# EAGLE design big shield (EAGLE 8.6.1)
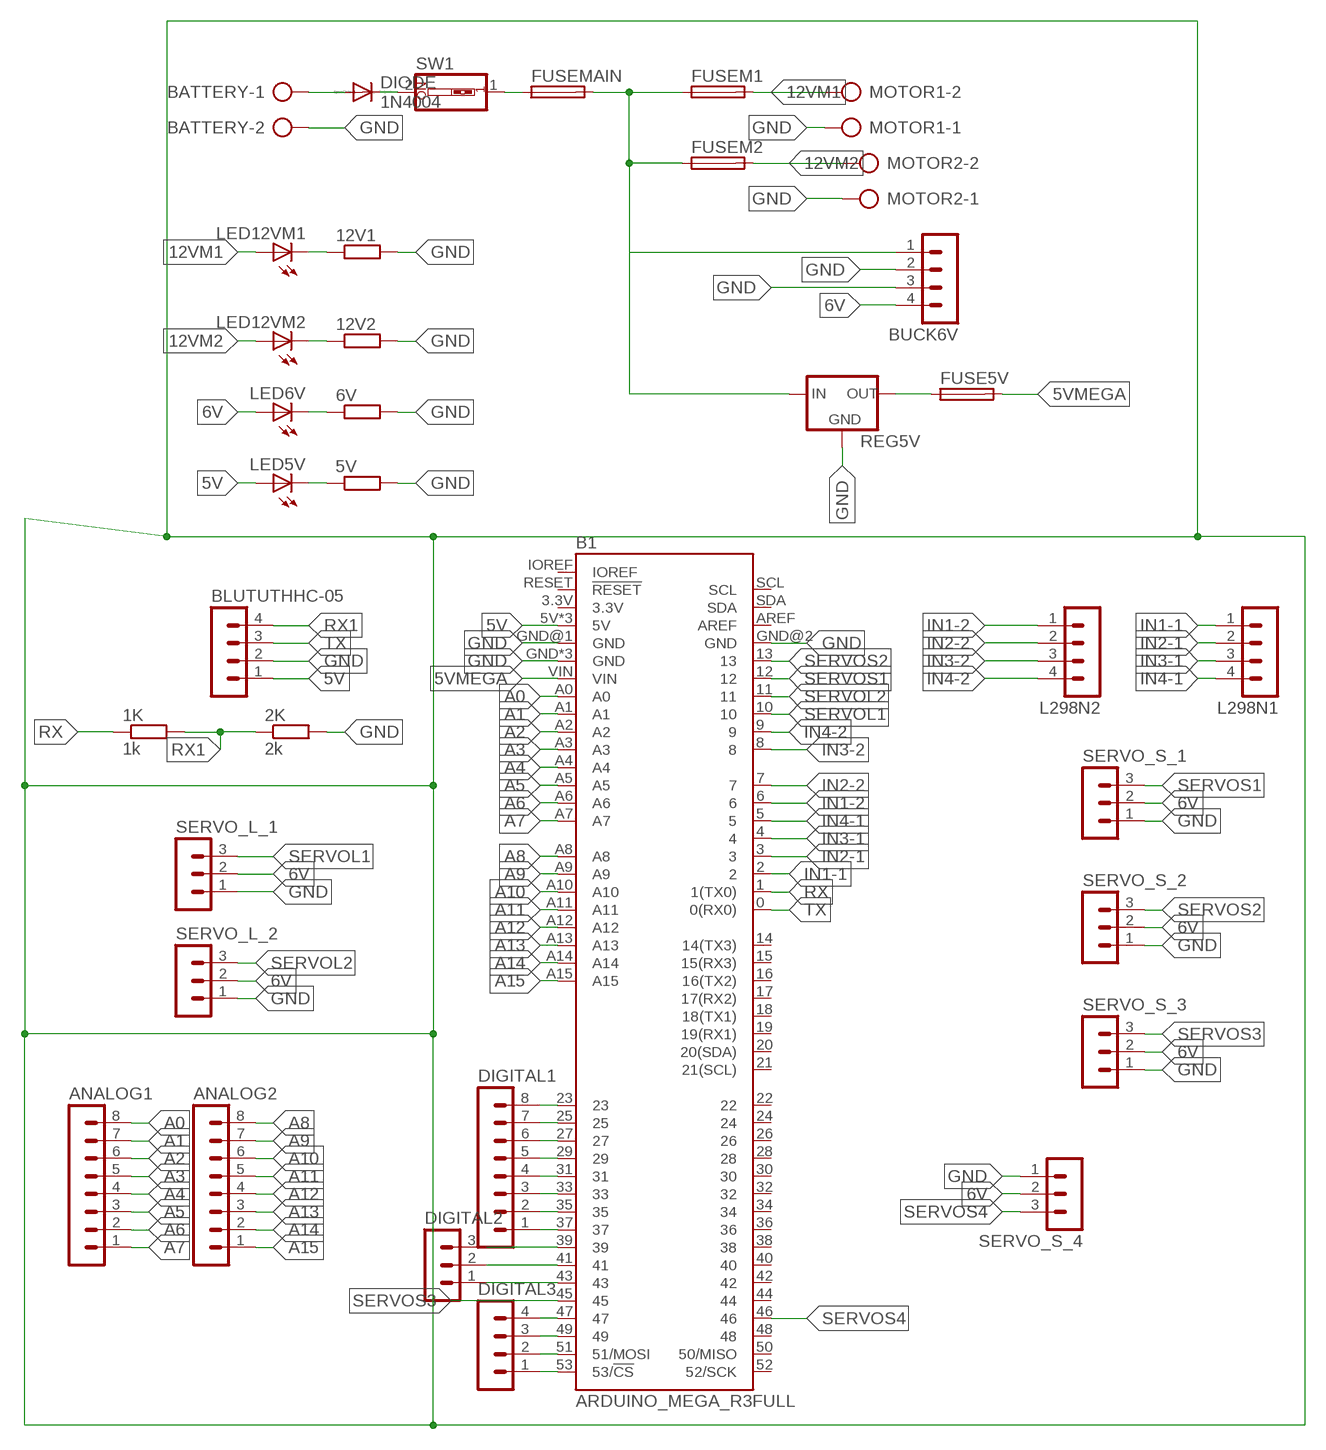
[diagram p0: schematic, sheet 1]

## Parts
1K  1k  R-EU_0207/10  [0207/10]
2K  2k  R-EU_0207/10  [0207/10]
5V  R-EU_0204/7  [0204/7]
6V  R-EU_0204/7  [0204/7]
12V1  R-EU_0204/7  [0204/7]
12V2  R-EU_0204/7  [0204/7]
ANALOG1  MA08-1  [MA08-1]
ANALOG2  MA08-1  [MA08-1]
B1  ARDUINO_MEGA_R3FULL  [ARDUINO_MEGA_NO_SILK]
BATTERY  AK500/2-H  [AK500/2-H]
BLUTUTHHC-05  MA04-1  [MA04-1]
BUCK6V  MA04-1  [MA04-1]
DIGITAL1  MA08-1  [MA08-1]
DIGITAL2  MA03-1  [MA03-1]
DIGITAL3  MA04-1  [MA04-1]
DIODE  1N4004  [DO41-10]
FUSE5V  SH22,5  [SH22,5]
FUSEM1  SH22,5  [SH22,5]
FUSEM2  SH22,5  [SH22,5]
FUSEMAIN  SH22,5  [SH22,5]
L298N1  MA04-1  [MA04-1]
L298N2  MA04-1  [MA04-1]
LED5V  LEDLSU260  [LSU260]
LED6V  LEDLSU260  [LSU260]
LED12VM1  LEDLSU260  [LSU260]
LED12VM2  LEDLSU260  [LSU260]
MOTOR1  AK500/2-H  [AK500/2-H]
MOTOR2  AK500/2-H  [AK500/2-H]
REG5V  78XXS  [78XXS]
SERVO_L_1  MA03-1  [MA03-1]
SERVO_L_2  MA03-1  [MA03-1]
SERVO_S_1  MA03-1  [MA03-1]
SERVO_S_2  MA03-1  [MA03-1]
SERVO_S_3  MA03-1  [MA03-1]
SERVO_S_4  MA03-1  [MA03-1]
SW1  SW_DIP-1  [EDG-01]

## Nets
5V: B1.5V B1.5V@1(5V) B1.5V@2(5V) BLUTUTHHC-05.1 LED5V.A
5VMEGA: B1.VIN FUSE5V.2
6V: BUCK6V.4 LED6V.A SERVO_L_1.2 SERVO_L_2.2 SERVO_S_1.2 SERVO_S_2.2 SERVO_S_3.2 SERVO_S_4.2
12V1: BUCK6V.1 FUSEM1.1 FUSEM2.1 FUSEMAIN.2 REG5V.IN
12VM1: FUSEM1.2 LED12VM1.A MOTOR1.2
12VM2: FUSEM2.2 LED12VM2.A MOTOR2.2
A0: ANALOG1.8 B1.A0
A1: ANALOG1.7 B1.A1
A2: ANALOG1.6 B1.A2
A3: ANALOG1.5 B1.A3
A4: ANALOG1.4 B1.A4
A5: ANALOG1.3 B1.A5
A6: ANALOG1.2 B1.A6
A7: ANALOG1.1 B1.A7
A8: ANALOG2.8 B1.A8
A9: ANALOG2.7 B1.A9
A10: ANALOG2.6 B1.A10
A11: ANALOG2.5 B1.A11
A12: ANALOG2.4 B1.A12
A13: ANALOG2.3 B1.A13
A14: ANALOG2.2 B1.A14
A15: ANALOG2.1 B1.A15
GND: 2K.2 5V.2 6V.2 12V1.2 12V2.2 B1.GND B1.GND@1(GND) B1.GND@2(GND) B1.GND@3(GND) B1.GND@4(GND) BATTERY.2 BLUTUTHHC-05.2 BUCK6V.2 BUCK6V.3 MOTOR1.1 MOTOR2.1 REG5V.GND SERVO_L_1.1 SERVO_L_2.1 SERVO_S_1.1 SERVO_S_2.1 SERVO_S_3.1 SERVO_S_4.1
IN1-1: B1.2 L298N1.1
IN1-2: B1.6 L298N2.1
IN2-1: B1.3 L298N1.2
IN2-2: B1.7 L298N2.2
IN3-1: B1.4 L298N1.3
IN3-2: B1.8 L298N2.3
IN4-1: B1.5 L298N1.4
IN4-2: B1.9 L298N2.4
N$1: BATTERY.1 DIODE.A
N$2: DIODE.C SW1.2
N$3: FUSEMAIN.1 SW1.1
N$6: FUSE5V.1 REG5V.OUT
N$7: 6V.1 LED6V.K(C)
N$8: 12V2.1 LED12VM2.K(C)
N$9: 12V1.1 LED12VM1.K(C)
N$10: 5V.1 LED5V.K(C)
N$26: B1.23 DIGITAL1.8
N$27: B1.25 DIGITAL1.7
N$28: B1.27 DIGITAL1.6
N$29: B1.29 DIGITAL1.5
N$30: B1.31 DIGITAL1.4
N$31: B1.33 DIGITAL1.3
N$32: B1.35 DIGITAL1.2
N$33: B1.37 DIGITAL1.1
N$34: B1.39 DIGITAL2.3
N$35: B1.41 DIGITAL2.2
N$36: B1.43 DIGITAL2.1
N$37: B1.47 DIGITAL3.4
N$38: B1.49 DIGITAL3.3
N$39: B1.51(51/MOSI) DIGITAL3.2
N$40: B1.53(53/!CS) DIGITAL3.1
RX: 1K.1 B1.1(1(TX0))
RX1: 1K.2 2K.1 BLUTUTHHC-05.4
SERVOL1: B1.10 SERVO_L_1.3
SERVOL2: B1.11 SERVO_L_2.3
SERVOS1: B1.12 SERVO_S_1.3
SERVOS2: B1.13 SERVO_S_2.3
SERVOS3: B1.45 SERVO_S_3.3
SERVOS4: B1.46 SERVO_S_4.3
TX: B1.0(0(RX0)) BLUTUTHHC-05.3
Unconnected: B1.3.3V B1.14(14(TX3)) B1.15(15(RX3)) B1.16(16(TX2)) B1.17(17(RX2)) B1.18(18(TX1)) B1.19(19(RX1)) B1.20(20(SDA)) B1.21(21(SCL)) B1.22 B1.24 B1.26 B1.28 B1.30 B1.32 B1.34 B1.36 B1.38 B1.40 B1.42 B1.44 B1.48 B1.50(50/MISO) B1.52(52/SCK) B1.AREF B1.IOREF B1.RESET(!RESET) B1.SCL B1.SDA

## Library data of the parts
1K 2K = rcl:R-EU_: RESISTOR, European symbol; SPICEPREFIX: R
5V 6V 12V1 12V2 = resistor:R-EU_: RESISTOR, European symbol
ANALOG1 ANALOG2 DIGITAL1 = con-lstb:MA08-1: PIN HEADER; OC_FARNELL: unknown; OC_NEWARK: unknown
B1 = SparkFun-Boards:ARDUINO_MEGA_R3: Arduino Mega R3 ATmega2560 R3 compatible footprint. SparkFun Products: Arduino Mega 2560 R3 <https://www.sparkfun.com/products/11061>
BATTERY MOTOR1 MOTOR2 = con-ptr500:AK500/2-H: CONNECTOR Aug. 2004 / PTR Meßtechnik: Die Bezeichnung der Serie AK505 wurde geändert. Es handelt sich hierbei um AK500 in horizontaler Ausführung.; OC_FARNELL: unknown; OC_NEWARK: unknown
BLUTUTHHC-05 BUCK6V DIGITAL3 L298N1 L298N2 = con-lstb:MA04-1: PIN HEADER; OC_FARNELL: unknown; OC_NEWARK: unknown
DIGITAL2 SERVO_L_1 SERVO_L_2 SERVO_S_1-SERVO_S_4 = con-lstb:MA03-1: PIN HEADER; OC_FARNELL: unknown; OC_NEWARK: unknown
DIODE = diode:1N4004: DIODE general purpose rectifier, 1 A
FUSE5V FUSEM1 FUSEM2 FUSEMAIN = fuse:SH22,5: FUSE HOLDER grid 22,5 mm, OGN0031 8201, Schurter (Buerklin); MF: SCHURTER; MPN: 0031.8201; OC_FARNELL: 1162740; OC_NEWARK: 96F8317
LED5V LED6V LED12VM1 LED12VM2 = led:LED: LED OSRAM: - CHIPLED LG R971, LG N971, LY N971, LG Q971, LY Q971, LO R971, LY R971 LH N974, LH R974 LS Q976, LO Q976, LY Q976 LO Q996 - Hyper CHIPLED LW Q18S LB Q993, LB Q99A, LB R99A - SideLED LS A670, LO A670, LY A670, LG A670, LP A670 LB A673, LV A673, LT A673, LW A673 LH A674 LY A675 LS A676, LA A676, LO A676, LY A676, LW A676 LS A679, LY A679, LG A679 - Hyper Micro SIDELED® LS Y876, LA Y876, LO Y876, LY Y876 LT Y87S - SmartLED LW L88C, LW L88S LB L89C, LB L89S, LG L890 LS L89K, LO L89K, LY L89K LS L896, LA L896, LO L896, LY L896 - TOPLED LS T670, LO T670, LY T670, LG T670, LP T670 LSG T670, LSP T670, LSY T670, LOP T670, LYG T670 LG T671, LOG T671, LSG T671 LB T673, LV T673, LT T673, LW T673 LH T674 LS T676, LA T676, LO T676, LY T676, LB T676, LH T676, LSB T676, LW T676 LB T67C, LV T67C, LT T67C, LS T67K, LO T67K, LY T67K, LW E67C LS E67B, LA E67B, LO E67B, LY E67B, LB E67C, LV E67C, LT E67C LW T67C LS T679, LY T679, LG T679 LS T770, LO T770, LY T770, LG T770, LP T770 LB T773, LV T773, LT T773, LW T773 LH T774 LS E675, LA E675, LY E675, LS T675 LS T776, LA T776, LO T776, LY T776, LB T776 LHGB T686 LT T68C, LB T68C - Hyper Mini TOPLED® LB M676 - Mini TOPLED Santana® LG M470 LS M47K, LO M47K, LY M47K Source: http://www.osram.convergy.de LUXEON: - LUMILED® LXK2-PW12-R00, LXK2-PW12-S00, LXK2-PW14-U00, LXK2-PW14-V00 LXK2-PM12-R00, LXK2-PM12-S00, LXK2-PM14-U00 LXK2-PE12-Q00, LXK2-PE12-R00, LXK2-PE12-S00, LXK2-PE14-T00, LXK2-PE14-U00 LXK2-PB12-K00, LXK2-PB12-L00, LXK2-PB12-M00, LXK2-PB14-N00, LXK2-PB14-P00, LXK2-PB14-Q00 LXK2-PR12-L00, LXK2-PR12-M00, LXK2-PR14-Q00, LXK2-PR14-R00 LXK2-PD12-Q00, LXK2-PD12-R00, LXK2-PD12-S00 LXK2-PH12-R00, LXK2-PH12-S00 LXK2-PL12-P00, LXK2-PL12-Q00, LXK2-PL12-R00 Source: www.luxeon.com KINGBRIGHT: KA-3528ASYC Source: www.kingbright.com
REG5V = v-reg:78XXS: VOLTAGE REGULATOR
SW1 = special:SW_DIP-1: DIP SWITCH

## Board
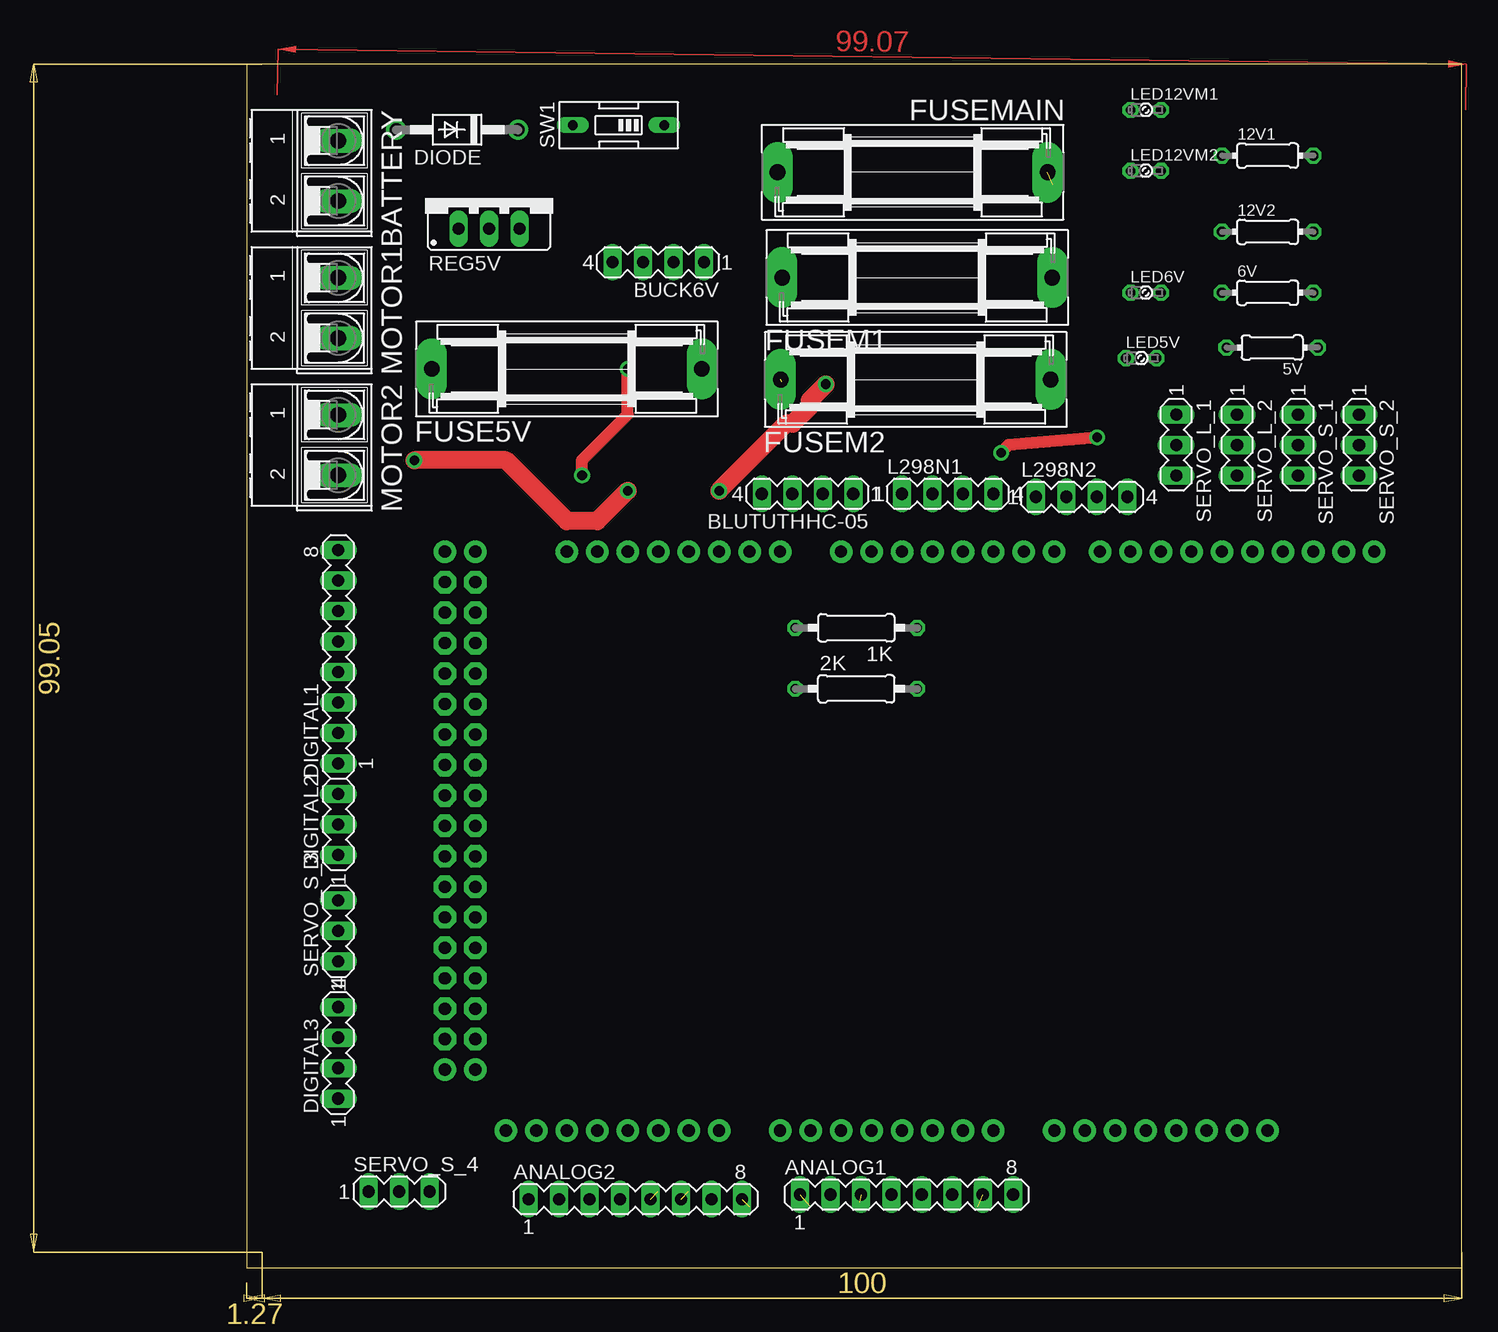
[diagram p1: board, top side]
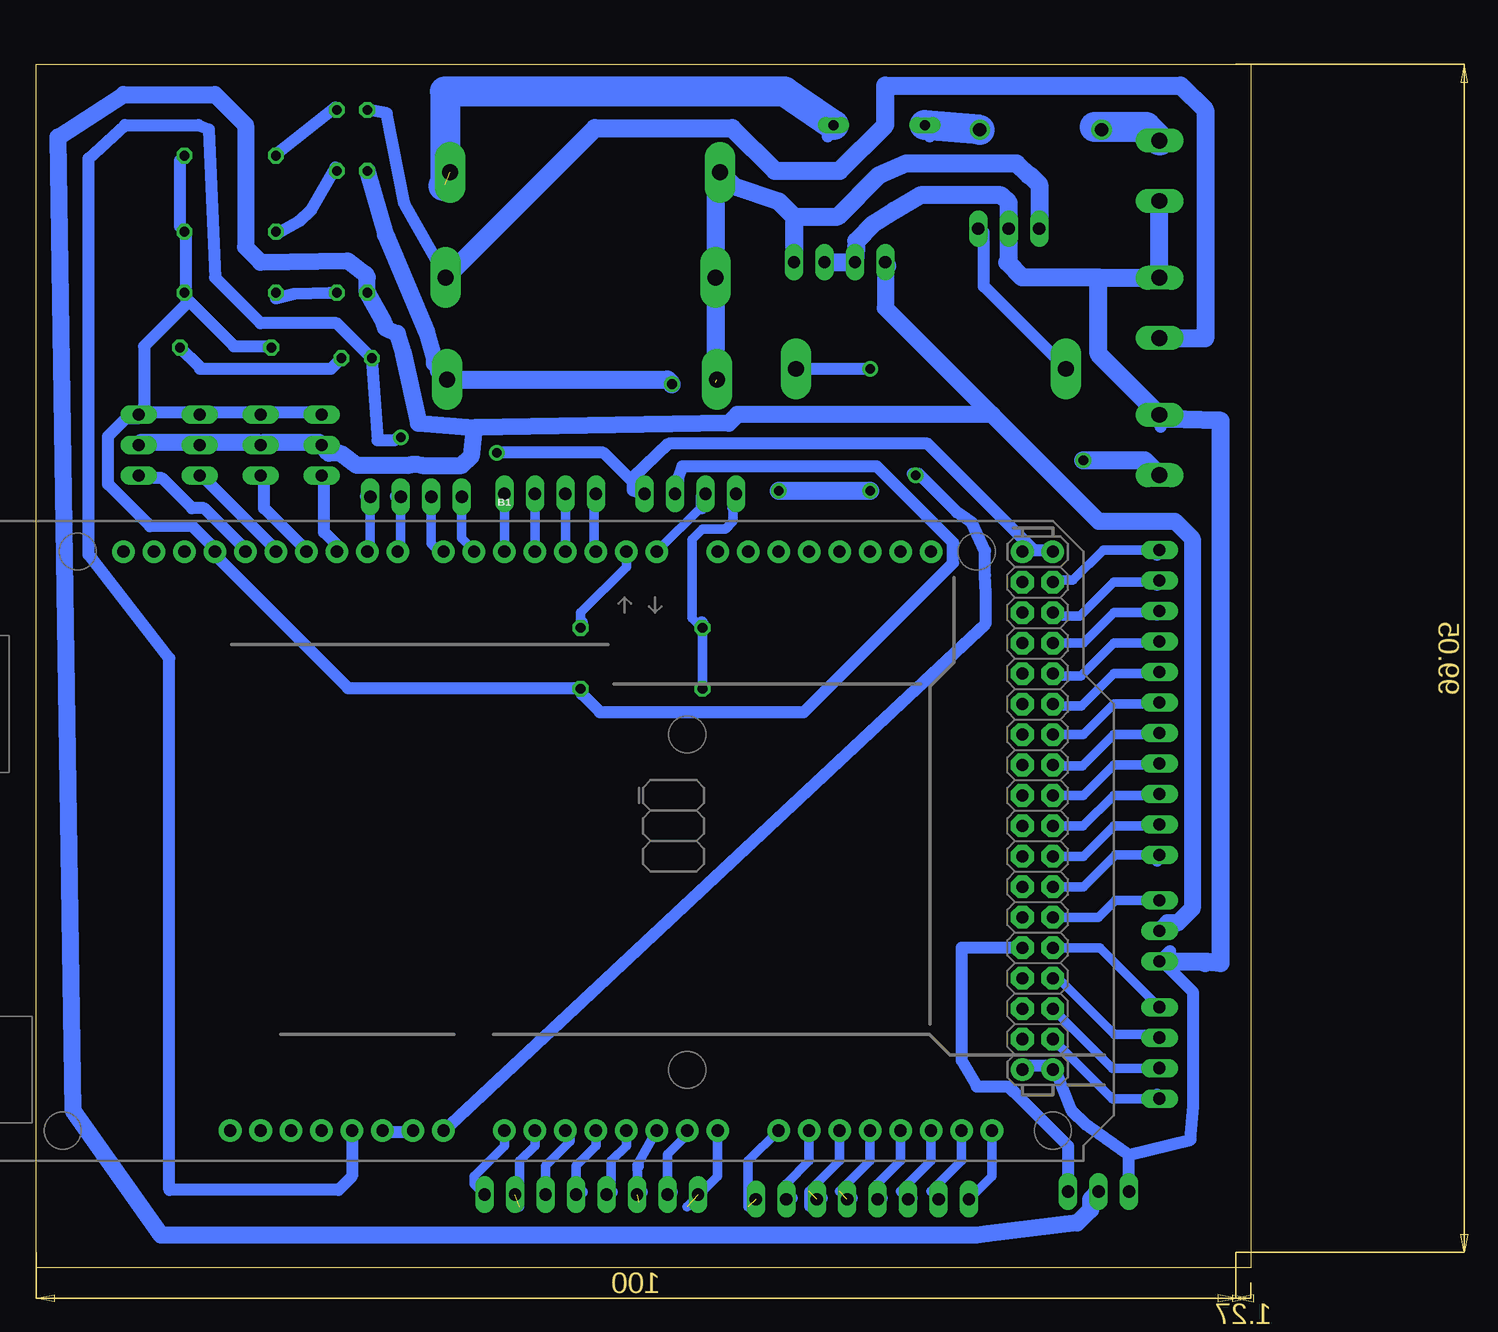
[diagram p2: board, bottom side, seen from below]

Size 101.27 x 100.32 mm. Coordinates in mm from the lower left corner, seen from the top.
Outline: 0,0 101.27,0 101.27,100.32 0,100.32 0,0
Copper layers (1*16): Top 0.035mm / dielectric 1.5mm / Bottom 0.035mm
Design rules "default *": minimum track width 1mm, minimum drill 0.35mm, track to track 0.4mm, track to pad 0.4mm, pad to pad 6mil, via to via 6mil, smd to smd 6mil, copper to edge 40mil, drill to drill 6mil, minimum pad ring 10mil, minimum via ring 8mil, stop-mask expansion 4mil, vias tented up to drill 0mil, thermal gap 10mil

### Footprints (pad centres in the part's own frame; a part is rotated, then mirrored left to right if it is on the bottom)
0207/10 = drill 0.813 octagon: 1 -5.08,0; 2 5.08,0
0204/7 = drill 0.813 octagon: 1 -3.81,0; 2 3.81,0
MA08-1 = drill 1.016 long: 1 -8.89,0; 2 -6.35,0; 3 -3.81,0; 4 -1.27,0; 5 1.27,0; 6 3.81,0; 7 6.35,0; 8 8.89,0
ARDUINO_MEGA_NO_SILK = drill 1.016 pad 1.88: 0 13.97,24.13; 1 11.43,24.13; 2 8.89,24.13; 3 6.35,24.13; 3.3V -13.97,-24.13; 4 3.81,24.13; 5 1.27,24.13; 5V -11.43,-24.13; 5V@1 44.45,24.13; 5V@2 46.99,24.13; 6 -1.27,24.13; 7 -3.81,24.13; 8 -7.62,24.13; 9 -10.16,24.13; 10 -12.7,24.13; 11 -15.24,24.13; 12 -17.78,24.13; 13 -20.32,24.13; 14 19.05,24.13; 15 21.59,24.13; 16 24.13,24.13; 17 26.67,24.13; 18 29.21,24.13; 19 31.75,24.13; 20 34.29,24.13; 21 36.83,24.13; A0 1.27,-24.13; A1 3.81,-24.13; A2 6.35,-24.13; A3 8.89,-24.13; A4 11.43,-24.13; A5 13.97,-24.13; A6 16.51,-24.13; A7 19.05,-24.13; A8 24.13,-24.13; A9 26.67,-24.13; A10 29.21,-24.13; A11 31.75,-24.13; A12 34.29,-24.13; A13 36.83,-24.13; A14 39.37,-24.13; A15 41.91,-24.13; AREF -25.4,24.13; GND -8.89,-24.13; GND@1 -6.35,-24.13; GND@2 44.45,-19.05; GND@3 46.99,-19.05; GND@4 -22.86,24.13; IOREF -19.05,-24.13; NC -21.59,-24.13; RESET -16.51,-24.13; SCL -30.48,24.13; SDA -27.94,24.13; VIN -3.81,-24.13 | drill 1.016 pad 1.88 octagon: 22 44.45,21.59; 23 46.99,21.59; 24 44.45,19.05; 25 46.99,19.05; 26 44.45,16.51; 27 46.99,16.51; 28 44.45,13.97; 29 46.99,13.97; 30 44.45,11.43; 31 46.99,11.43; 32 44.45,8.89; 33 46.99,8.89; 34 44.45,6.35; 35 46.99,6.35; 36 44.45,3.81; 37 46.99,3.81; 38 44.45,1.27; 39 46.99,1.27; 40 44.45,-1.27; 41 46.99,-1.27; 42 44.45,-3.81; 43 46.99,-3.81; 44 44.45,-6.35; 45 46.99,-6.35; 46 44.45,-8.89; 47 46.99,-8.89; 48 44.45,-11.43; 49 46.99,-11.43; 50 44.45,-13.97; 51 46.99,-13.97; 52 44.45,-16.51; 53 46.99,-16.51
AK500/2-H = drill 1.321 long: 1 -2.515,0; 2 2.515,0
MA04-1 = drill 1.016 long: 1 -3.81,0; 2 -1.27,0; 3 1.27,0; 4 3.81,0
MA03-1 = drill 1.016 long: 1 -2.54,0; 2 0,0; 3 2.54,0
DO41-10 = drill 1.118: A 5.08,0; C -5.08,0
SH22,5 = drill 1.321 pad 2.54 long: 1 -11.252,0; 2 11.252,0
LSU260 = drill 0.813 octagon: A -1.27,0; K 1.27,0
78XXS = drill 1.016 long: GND 0,-2.54; IN -2.54,-2.54; OUT 2.54,-2.54
EDG-01 = drill 0.813 long: 1 0,-3.81; 2 0,3.81

### Placement (x,y rotation side)
1K  50.8,53.34 180 top
2K  50.8,48.26 0 top
5V  85.47,76.71 180 top
6V  85.09,81.28 0 top
12V1  85.09,92.71 0 top
12V2  85.09,86.36 0 top
ANALOG1  54.99,6.1 0 top
ANALOG2  32.38,5.71 0 top
B1  63.5,35.56 0 bottom
BATTERY  7.62,91.44 270 top
BLUTUTHHC-05  46.74,64.52 180 top
BUCK6V  34.29,83.82 180 top
DIGITAL1  7.62,50.93 90 top
DIGITAL2  7.62,36.96 90 top
DIGITAL3  7.62,17.91 90 top
DIODE  17.53,94.87 180 top
FUSE5V  26.67,74.93 0 top
FUSEM1  55.88,82.55 0 top
FUSEM2  55.75,74.04 0 top
FUSEMAIN  55.5,91.31 180 top
L298N1  58.42,64.52 0 top
L298N2  69.6,64.26 0 top
LED5V  74.55,75.82 0 top
LED6V  74.93,81.28 0 top
LED12VM1  74.93,96.52 0 top
LED12VM2  74.93,91.44 0 top
MOTOR1  7.62,80.01 270 top
MOTOR2  7.62,68.58 270 top
REG5V  20.19,89.15 0 top
SERVO_L_1  77.47,68.58 270 top
SERVO_L_2  82.55,68.58 270 top
SERVO_S_1  87.63,68.58 270 top
SERVO_S_2  92.71,68.58 270 top
SERVO_S_3  7.62,28.07 90 top
SERVO_S_4  12.7,6.35 0 top
SW1  30.99,95.25 90 top

### Tracks (layer width: path | path; a pad name or v marks a point on that pad's centre or on a via)
5V  (via drill 0.8 pad 1.3)
  Top 1: v70.87,69.22 63.5,68.58 v62.87,67.95
  Bottom 1: 18.77,59.81 18.08,59.81 | 18.08,59.81 16.77,59.81 B1.5V@2 | 18.77,59.81 B1.5V@1 19.27,59.81 18.77,59.81 | B1.5V 74.93,7.62 76.07,6.48 90.17,6.48 90.17,50.8 96.9,59.44 96.9,92.46 93.86,95.25 87.73,95.25 86.87,94.89 86.36,82.55 82.55,78.74 76.2,78.74 LED5V.A 72.8,68.99 71.41,68.99 71.25,69.09 v70.87,69.22 | v62.87,67.95 53.98,67.95 BLUTUTHHC-05.1 51.54,64.81 51.54,65.81 48.54,68.68 26.95,68.68 18.08,59.81
5VMEGA  (via drill 0.8 pad 1.3)
  Top 1: v27.94,66.04 27.94,67.31 31.75,71.12 v31.75,74.93
  Bottom 1: B1.VIN 22.1,53.72 22.1,56.26 22.16,57.72 22.16,59.76 23.24,62.11 24.51,62.99 27.69,66.17 28.07,66.17 | 28.19,66.17 28.07,66.17 | 28.07,66.17 v27.94,66.04 | v31.75,74.93 FUSE5V.2
6V
  Bottom 1: 82.77,68.81 SERVO_L_2.2 82.27,68.81 | 87.27,68.81 SERVO_S_1.2 | 76.77,67.81 77.27,68.31 SERVO_L_1.2 77.77,68.81 | 6.31,28.44 7.31,28.44 SERVO_S_3.2 | 30.27,83.5 BUCK6V.4 | 73.66,82.55 73.66,82.68 73.79,82.8
  Bottom 1.4: SERVO_S_3.2 6.94,28.74 6.09,28.74 4.89,29.95 4.89,60.77 6.35,62.23 12.7,62.23 21.59,71.12 | 21.59,71.12 42.8,71.12 43.52,70.4 64.77,70.02 | SERVO_S_4.2 13.38,5.67 13.38,4.82 14.47,3.73 21.96,2.84 22.85,2.71 90.85,2.71 98.16,13.07 99.43,94.25 93.98,97.79 86.36,97.79 83.82,95.25 83.82,85.09 82.55,83.82 75.31,83.95 73.79,82.8 | 73.66,82.55 LED6V.A 72.26,78.74 72.14,78.34 71.17,77.88 70.66,76.25 69.38,70.4 64.77,70.02 | 64.77,70.02 65.02,67.61 65.79,66.89 69.1,66.89 69.51,66.98 69.88,66.98 70.42,66.89 74.54,66.89 75.94,67.9 76.86,67.9 77.27,68.31 | SERVO_L_1.2 77.7,68.81 82.27,68.81 | SERVO_L_2.2 82.78,68.81 87.77,68.81 87.77,68.72 SERVO_S_1.2 87.86,68.81 92.48,68.81 SERVO_S_2.2 | 30.27,83.5 30.48,83.29 30.48,80.01 21.59,71.12
12V1  (1 unrouted)
  Bottom 1: 44.77,74.31 FUSEM2.1 | 44.77,82.31 FUSEM1.1 44.27,82.81 | 44.27,91.31 FUSEMAIN.2
  Bottom 1.5: 38.1,87.63 39.37,88.9 43.1,90.17 FUSEMAIN.2 44.63,90.93 FUSEM1.1 44.63,73.84 44.45,73.66 | 38.1,87.63 BUCK6V.1 | REG5V.IN 17.65,90.3 18.41,91.06 18.52,91.06 19.53,92.07 28.73,92.07 31.01,91.06 34.44,87.63 38.1,87.63
12VM1
  Bottom 1: LED12VM1.A 72.04,96.24 70.54,88.62 67.27,82.81 FUSEM1.2 66.77,82.81
  Bottom 1.5: FUSEM1.2 54.68,95 43.24,95 39.68,91.44 34.29,91.44 30.48,95.25 30.48,98.55 5.84,98.55 3.81,96.52 3.81,77.47 7.6,77.47 MOTOR1.2
12VM2  (via drill 0.8 pad 1.3)
  Top 1.5: v48.26,73.66 46.92,72.32 46.92,71.77 45.5,70.35 44.95,70.35 v39.37,64.77 | v31.75,64.77 29.21,62.23 26.67,62.23 21.59,67.31 v13.97,67.31
  Bottom 1.4: LED12VM2.A 72.14,86.11 68.71,77.98 68.05,75.68 68.05,75.4 67.72,75.07 67.72,74.76 FUSEM2.2
  Bottom 1.5: FUSEM2.2 48.64,74.04 v48.26,73.66 | v39.37,64.77 v31.75,64.77 | v13.97,67.31 8.87,67.31 MOTOR2.2
A0
  Bottom 0.8: B1.A0 62.23,10.16 64.77,7.62 64.77,6.98 ANALOG1.8
  Bottom 1: 63.77,6.31 ANALOG1.8 | B1.A0 62.27,11.31
A1  (1 unrouted)
  Bottom 0.8: B1.A1 59.69,10.16 60.96,8.89 60.96,5.08
  Bottom 1: 61.27,6.31 ANALOG1.7 | 59.27,11.31 B1.A1
A2
  Bottom 0.8: B1.A2 57.03,11.31 56.77,11.31 56.77,10.54 58.8,8.51 ANALOG1.6
  Bottom 1: 58.77,6.31 ANALOG1.6
A3
  Bottom 0.8: B1.A3 54.61,10.16 56.26,8.51 ANALOG1.5
  Bottom 1: 55.77,6.31 ANALOG1.5 | 54.27,11.31 B1.A3
A4
  Bottom 0.8: B1.A4 52.07,10.16 53.34,8.89 53.34,6.38 53.27,6.31
  Bottom 1: 53.27,6.31 ANALOG1.4 | 51.77,11.31 B1.A4
A5  (1 unrouted)
  Bottom 0.8: B1.A5 51,8.82 51,8.39 51.18,8.59 51.05,5.46
  Bottom 1: 50.77,6.31 ANALOG1.3 | 49.27,11.31 B1.A5
A6
  Bottom 0.8: B1.A6 46.87,11.31 46.77,11.31 48.64,9.44 ANALOG1.2
  Bottom 1: 48.27,6.31 ANALOG1.2
A7  (1 unrouted)
  Bottom 0.8: B1.A7 44.45,7.62 46.99,5.08
  Bottom 1: 45.77,6.31 ANALOG1.1 | 44.27,11.31 B1.A7
A8  (1 unrouted)
  Bottom 0.8: B1.A8 41.91,8.89 41.91,5.08
  Bottom 1: 41.27,5.81 ANALOG2.8 | 39.77,11.31 B1.A8
A9
  Bottom 0.8: B1.A9 36.83,8.89 38.74,6.98 ANALOG2.7
  Bottom 1: 38.27,5.81 ANALOG2.7 | 36.77,11.31 B1.A9
A10  (1 unrouted)
  Bottom 0.8: B1.A10 34.29,8.89 36.83,6.35 36.83,5.08
  Bottom 1: 35.77,5.81 ANALOG2.6 | 34.27,11.31 B1.A10
A11  (1 unrouted)
  Bottom 0.8: B1.A11 31.75,8.89 34.29,6.35
  Bottom 1: 33.27,5.81 ANALOG2.5 | 31.77,11.31 B1.A11
A12
  Bottom 0.8: B1.A12 29.21,8.89 31.11,6.98 ANALOG2.4
  Bottom 1: 30.77,5.81 ANALOG2.4 | 28.77,11.31 B1.A12
A13
  Bottom 0.8: B1.A13 26.67,8.89 29.21,6.35 ANALOG2.3
  Bottom 1: 28.27,5.81 ANALOG2.3 | 26.27,11.31 B1.A13
A14
  Bottom 0.8: B1.A14 24.13,8.89 26.67,6.35 26.31,6.35 25.77,5.81
  Bottom 1: 25.77,5.81 ANALOG2.2 | 23.77,11.31 B1.A14
A15
  Bottom 0.8: B1.A15 21.59,7.62 23.27,5.94 23.27,5.81
  Bottom 1: 23.27,5.81 ANALOG2.1 | 21.27,11.31 B1.A15
GND
  Bottom 1: 8.04,82.58 MOTOR1.1 8.04,83.08 | 8.04,71.58 MOTOR2.1 7.54,71.08 | 8.04,88.58 BATTERY.2 | SERVO_L_1.1 77.77,71.31 82.27,71.31 SERVO_L_2.1 82.77,71.31 87.27,71.31 SERVO_S_1.1 87.77,71.31 92.27,71.31 SERVO_S_2.1 | 88.52,80.56 88.77,80.81 6V.2 88.77,81.31 88.77,86.31 12V2.2 89.27,86.81 89.27,92.31 12V1.2 | 88.52,80.56 84.77,76.81 81.77,76.81 5V.2 | 88.52,80.56 92.27,76.81 92.27,71.81 SERVO_S_2.1 | 10.16,9.4 5.04,10.67 4.81,13.44 4.81,22.94 7.31,25.44 SERVO_S_3.1 | BLUTUTHHC-05.2 47.77,64.81 47.77,65.81 47.41,66.8 31.18,66.8 24.83,60.45 24.83,58.75 37.27,46.31 54.27,46.31 55.77,47.81 2K.2 56.27,48.31 75.27,48.31 86.27,59.31 B1.GND@4 86.27,59.81 88.27,61.81 91.77,61.81 95.27,65.31 95.27,69.31 93.77,70.81 92.77,70.81 SERVO_S_2.1 | B1.GND@1 70.27,11.31 72.27,11.31 B1.GND | B1.GND@2 18.77,16.81 16.77,16.81 B1.GND@3 16.27,16.31 15,13.17 13.77,11.94 10.16,9.4 | 7.54,70.08 7.54,71.08 | 6.81,25.44 SERVO_S_3.1 | SERVO_S_4.1 10.16,9.4 | SERVO_S_3.1 6.74,26.4 | 2.79,70.74 7.5,71.12 7.54,71.08
  Bottom 1.5: BUCK6V.2 BUCK6V.3 32.89,85.6 31.5,87 29.72,88.14 27.56,89.41 20.83,89.41 20.19,88.77 REG5V.GND 20.19,83.95 20.32,83.82 19.05,82.55 12.7,82.55 | MOTOR2.1 12.7,76.17 12.7,82.55 | 12.7,82.55 8.07,82.55 8.04,82.58 | MOTOR1.1 BATTERY.2 | SERVO_S_3.1 3.94,25.53 3.81,25.4 3.68,25.53 2.53,25.4 2.53,70.61 7.2,70.74 7.54,71.08
IN1-1
  Bottom 0.8: L298N1.1 54.77,64.36 54.77,59.81
  Bottom 1: 54.77,59.81 B1.2
IN1-2
  Bottom 0.8: L298N2.1 65.79,60.83 64.77,59.81
  Bottom 1: 65.77,64.31 L298N2.1 | 64.77,59.81 B1.6
IN2-1
  Bottom 0.8: L298N1.2 57.15,59.93 57.27,59.81
  Bottom 1: 57.27,64.31 L298N1.2 | 57.27,59.81 B1.3
IN2-2
  Bottom 0.8: 68.58,63.5 68.33,63.75 L298N2.2 68.33,60.37 67.77,59.81
  Bottom 1: 68.27,64.31 L298N2.2 | 67.77,59.81 B1.7
IN3-1
  Bottom 0.8: L298N1.3 59.69,59.89 59.77,59.81
  Bottom 1: 59.77,64.31 L298N1.3 | 59.77,59.81 B1.4
IN3-2
  Bottom 0.8: L298N2.3 70.87,60.21 71.27,59.81
  Bottom 1: 71.27,64.31 L298N2.3 | 71.27,59.81 B1.8
IN4-1
  Bottom 0.8: L298N1.4 62.23,59.85 62.27,59.81
  Bottom 1: 62.27,64.31 L298N1.4 | 62.27,59.81 B1.5
IN4-2
  Bottom 0.8: L298N2.4 73.41,60.17 73.77,59.81
  Bottom 1: 73.77,64.31 L298N2.4 | 73.77,59.81 B1.9
N$1
  Bottom 1: 9.04,95.08 8.04,94.08 BATTERY.1 | 13.04,95.08 DIODE.A
  Bottom 2.5: BATTERY.1 8.74,95.08 13.04,95.08
N$2
  Bottom 1: 26.77,94.31 SW1.2 | 22.27,94.31 DIODE.C
  Bottom 2.5: DIODE.C SW1.2
N$3  (1 unrouted)
  Bottom 1: 35.27,94.31 SW1.1 | 66.27,91.81 FUSEMAIN.1
  Bottom 2.5: SW1.1 38.87,98.05 67.18,98.05 67.18,90.3 67.31,90.17
N$6
  Bottom 1: REG5V.OUT 22.27,86.31 22.27,81.81 15.77,75.31 FUSE5V.1
N$7
  Bottom 1: LED6V.K 76.82,81.28 79.78,81.19 81.27,80.81 6V.1
N$8
  Bottom 1: LED12VM2.K 76.31,91.74 78.33,88.18 79.39,87.22 81.16,86.2 81.27,86.31 12V2.1
N$9
  Bottom 1: LED12VM1.K 76.31,96.74 81.27,92.81 12V1.1
N$10
  Bottom 1: LED5V.K 76.71,74.93 87.63,74.93 87.63,75.06 5V.1
N$26
  Bottom 0.8: DIGITAL1.8 12.32,59.82 14.83,57.31 16.27,57.31
  Bottom 1: 7.81,59.44 DIGITAL1.8 | 16.27,57.31 B1.23
N$27
  Bottom 0.8: DIGITAL1.7 7.75,57.15 11.43,57.15 14.27,54.31 16.27,54.31
  Bottom 1: 7.81,56.94 DIGITAL1.7 | 16.27,54.31 B1.25
N$28
  Bottom 0.8: DIGITAL1.6 7.75,54.61 11.43,54.61 13.97,52.07 B1.27
  Bottom 1: 7.81,54.44 DIGITAL1.6 | 16.27,51.81 B1.27
N$29
  Bottom 0.8: DIGITAL1.5 7.75,52.07 11.43,52.07 14.19,49.31 16.27,49.31
  Bottom 1: 7.81,51.94 DIGITAL1.5 | 16.27,49.31 B1.29
N$30
  Bottom 0.8: DIGITAL1.4 7.75,49.53 11.43,49.53 14.15,46.81 16.27,46.81
  Bottom 1: 7.81,49.44 DIGITAL1.4 | 16.27,46.81 B1.31
N$31
  Bottom 0.8: DIGITAL1.3 7.75,46.99 11.43,46.99 13.97,44.45 B1.33
  Bottom 1: 7.81,46.94 DIGITAL1.3 | 16.27,44.31 B1.33
N$32
  Bottom 0.8: DIGITAL1.2 7.75,44.45 11.43,44.45 14.07,41.81 16.27,41.81
  Bottom 1: 7.81,44.44 DIGITAL1.2 | 16.27,41.81 B1.35
N$33
  Bottom 0.8: DIGITAL1.1 7.75,41.91 11.43,41.91 13.97,39.37 B1.37
  Bottom 1: 7.81,41.94 DIGITAL1.1 | 16.27,39.31 B1.37
N$34
  Bottom 0.8: DIGITAL2.3 7.75,39.37 11.43,39.37 13.99,36.81 16.27,36.81
  Bottom 1: 7.81,39.44 DIGITAL2.3 | 16.27,36.81 B1.39
N$35
  Bottom 0.8: DIGITAL2.2 7.75,36.83 11.43,36.83 13.97,34.29 16.25,34.29 16.27,34.31
  Bottom 1: 7.81,36.94 DIGITAL2.2 | 16.27,34.31 B1.41
N$36
  Bottom 0.8: DIGITAL2.1 11.3,34.42 13.97,31.75 16.21,31.75 16.27,31.81
  Bottom 1: 7.81,33.94 DIGITAL2.1 | 16.27,31.81 B1.43
N$37
  Bottom 0.8: DIGITAL3.4 12.57,26.67 B1.47
  Bottom 1: 7.81,21.94 DIGITAL3.4 | 16.27,26.81 B1.47
N$38
  Bottom 0.8: DIGITAL3.3 7.81,19.37 7.81,19.44 11.4,19.44 16.27,24.31
  Bottom 1: 16.27,24.31 B1.49
N$39
  Bottom 0.8: DIGITAL3.2 11.56,16.64 B1.51
  Bottom 1: 7.81,16.56 DIGITAL3.2 | B1.51 16.27,21.81
N$40
  Bottom 0.8: DIGITAL3.1 11.56,14.1 B1.53
  Bottom 1: 7.81,14.44 DIGITAL3.1 | B1.53 16.27,19.31
RX
  Bottom 0.8: 1K.1 55.88,54.61 52.07,58.42 52.07,59.11 52.27,59.31
  Bottom 1: 55.77,53.81 1K.1 | 52.27,59.31 B1.1
RX1
  Bottom 0.8: BLUTUTHHC-05.4 42.93,63.65 43.27,63.31 43.18,63.22 43.18,62.23 43.82,61.59 45.72,61.59 46.61,60.71 46.61,54.15 45.77,53.31 | 1K.2 45.72,48.36 45.77,48.31
  Bottom 1: 45.77,48.31 2K.1 | 45.77,53.31 1K.2 45.77,53.81
SERVOL1
  Bottom 1: SERVO_L_1.3 77.27,65.81 77.27,61.31 75.77,59.81 B1.10
SERVOL2
  Bottom 1: SERVO_L_2.3 82.27,65.81 82.27,63.31 78.77,59.81 B1.11
SERVOS1
  Bottom 1: SERVO_S_1.3 87.27,65.81 81.27,59.81 B1.12
SERVOS2
  Bottom 1: SERVO_S_2.3 92.27,65.81 90.77,65.81 88.27,63.31 87.27,63.31 83.77,59.81 B1.13
SERVOS3
  Bottom 0.8: SERVO_S_3.3 11.3,30.61 12.7,29.21 16.17,29.21 16.27,29.31
  Bottom 1: 7.81,30.44 SERVO_S_3.3 | 16.27,29.31 B1.45
SERVOS4
  Bottom 1: B1.46 24.13,26.67 24.13,17.27 22.86,15.11 21.59,15.11 21.02,15.11 20.25,15.11 19.81,14.67 19.75,14.67 15.24,10.16 SERVO_S_4.3
TX
  Bottom 0.8: B1.0 45.77,63.45 45.77,64.31
  Bottom 1: 45.77,63.31 45.77,64.31 BLUTUTHHC-05.3 | 49.27,59.81 B1.0
(copper drawn outside any net)
  shapes: Top area x1